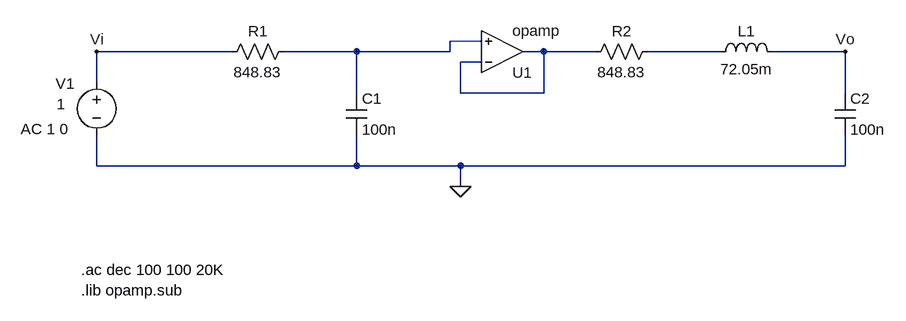
[diagram p0: schematic TS3.asc]
TS3.asc, the LTspice schematic file:
Version 4
SHEET 1 880 680
WIRE 144 112 96 112
WIRE -240 128 -448 128
WIRE -48 128 -160 128
WIRE 96 128 96 112
WIRE 96 128 -48 128
WIRE 240 128 208 128
WIRE 320 128 240 128
WIRE 512 128 400 128
WIRE 704 128 592 128
WIRE 144 144 112 144
WIRE -448 176 -448 128
WIRE -48 192 -48 128
WIRE 112 192 112 144
WIRE 240 192 240 128
WIRE 240 192 112 192
WIRE 704 192 704 128
WIRE -448 304 -448 256
WIRE -48 304 -48 256
WIRE -48 304 -448 304
WIRE 112 304 -48 304
WIRE 704 304 704 256
WIRE 704 304 112 304
WIRE 112 336 112 304
FLAG 112 336 0
FLAG 704 128 Vo
FLAG -448 128 Vi
SYMBOL cap -64 192 R0
SYMATTR InstName C1
SYMATTR Value 100n
SYMBOL cap 688 192 R0
SYMATTR InstName C2
SYMATTR Value 100n
SYMBOL res -144 112 R90
WINDOW 0 0 56 VBottom 2
WINDOW 3 32 56 VTop 2
SYMATTR InstName R1
SYMATTR Value 848.83
SYMBOL res 416 112 R90
WINDOW 0 0 56 VBottom 2
WINDOW 3 32 56 VTop 2
SYMATTR InstName R2
SYMATTR Value 848.83
SYMBOL ind 496 144 R270
WINDOW 0 32 56 VTop 2
WINDOW 3 5 56 VBottom 2
SYMATTR InstName L1
SYMATTR Value 72.05m
SYMBOL OpAmps\\opamp 176 192 M180
SYMATTR InstName U1
SYMBOL voltage -448 160 R0
WINDOW 3 -62 49 Left 2
WINDOW 123 -117 87 Left 2
WINDOW 39 0 0 Left 0
WINDOW 0 -63 17 Left 2
SYMATTR Value 1
SYMATTR Value2 AC 1 0
SYMATTR InstName V1
TEXT -472 496 Left 2 !.lib opamp.sub
TEXT -472 464 Left 2 !.ac dec 100 100 20K

The netlist it stands for:
* TS3.asc
C1 N001 0 100n
C2 Vo 0 100n
R1 N001 Vi 848.83
R2 N003 N002 848.83
L1 N003 Vo 72.05m
XU1 N002 N001 N002 opamp Aol=100K GBW=10Meg  ; pins invin noninvin out
V1 Vi 0 1 AC 1 0
.lib opamp.sub
.ac dec 100 100 20K
.backanno
.end